# Altium project PCB_60PIN_120PIN.PRJPCB
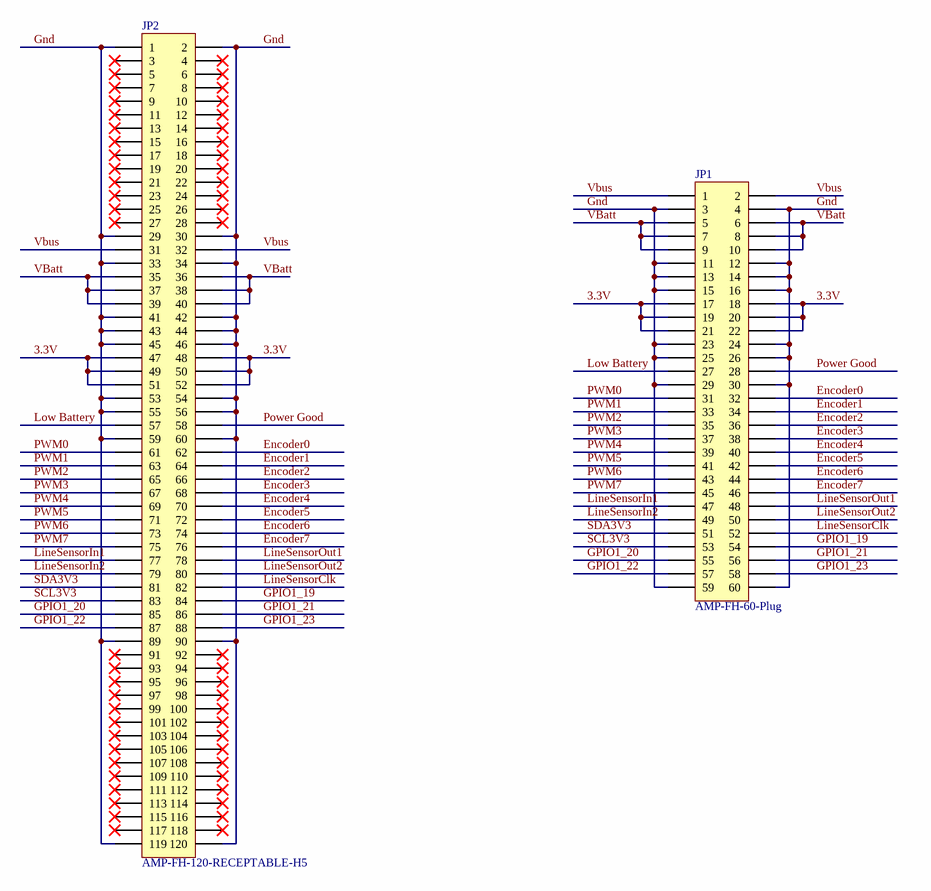
[diagram p0: 60Pin_120Pin.SCHDOC]
1 sheet, 3 parts. Net scope: global (net labels, ports and power ports of the same name join across sheets).
Board file: 60Pin_120Pin.PCBDOC

## Sheet 60Pin_120Pin.SCHDOC: GECKO3power 60-120 Pin Converter
size A4; Organization: Berne University of Applied Science; Address1: Quellgasse 21; Address2: CH-2500 Biel/Bienne; Address3: Switzerland; Revision: 1.0; SheetNumber: 1; SheetTotal: 1; ApprovedBy: zac1; Author: mnb1

### Parts
JP1  AMP-FH-60-Plug  [amp_FH_.8mm_60pin_plug]
JP2  AMP-FH-120-RECEPTABLE-H5  [amp_FH_.8mm_120pin_r_H5]
  CC License  [CC-License]  (value not drawn)

### Nets
3.3V: JP1.17 JP1.18 JP1.19 JP1.20 JP1.21 JP1.22 JP2.47 JP2.48 JP2.49 JP2.50 JP2.51 JP2.52
Encoder0: JP1.32 JP2.62
Encoder1: JP1.34 JP2.64
Encoder2: JP1.36 JP2.66
Encoder3: JP1.38 JP2.68
Encoder4: JP1.40 JP2.70
Encoder5: JP1.42 JP2.72
Encoder6: JP1.44 JP2.74
Encoder7: JP1.46 JP2.76
Gnd: JP1.3 JP1.4 JP1.11 JP1.12 JP1.13 JP1.14 JP1.15 JP1.16 JP1.23 JP1.24 JP1.25 JP1.26 JP1.29 JP1.30 JP1.59 JP1.60 JP2.1 JP2.2 JP2.29 JP2.30 JP2.33 JP2.34 JP2.41 JP2.42 JP2.43 JP2.44 JP2.45 JP2.46 JP2.53 JP2.54 JP2.55 JP2.56 JP2.59 JP2.60 JP2.89 JP2.90 JP2.119 JP2.120
GPIO1_19: JP1.54 JP2.84
GPIO1_20: JP1.55 JP2.85
GPIO1_21: JP1.56 JP2.86
GPIO1_22: JP1.57 JP2.87
GPIO1_23: JP1.58 JP2.88
LineSensorClk: JP1.52 JP2.82
LineSensorIn1: JP1.47 JP2.77
LineSensorIn2: JP1.49 JP2.79
LineSensorOut1: JP1.48 JP2.78
LineSensorOut2: JP1.50 JP2.80
Low Battery: JP1.27 JP2.57
Power Good: JP1.28 JP2.58
PWM0: JP1.31 JP2.61
PWM1: JP1.33 JP2.63
PWM2: JP1.35 JP2.65
PWM3: JP1.37 JP2.67
PWM4: JP1.39 JP2.69
PWM5: JP1.41 JP2.71
PWM6: JP1.43 JP2.73
PWM7: JP1.45 JP2.75
SCL3V3: JP1.53 JP2.83
SDA3V3: JP1.51 JP2.81
VBatt: JP1.5 JP1.6 JP1.7 JP1.8 JP1.9 JP1.10 JP2.35 JP2.36 JP2.37 JP2.38 JP2.39 JP2.40
Vbus: JP1.1 JP1.2 JP2.31 JP2.32

Not connected (* = marked no-connect by the designer): JP2 3* 4* 5* 6* 7* 8* 9* 10* 11* 12* 13* 14* 15* 16* 17* 18* 19* 20* 21* 22* 23* 24* 25* 26* 27* 28* 91* 92* 93* 94* 95* 96* 97* 98* 99* 100* 101* 102* 103* 104* 105* 106* 107* 108* 109* 110* 111* 112* 113* 114* 115* 116* 117* 118*

### Notes on the sheet
- Title:
- Size:
- Date:
- A4_L
- Author:
- Time:
- Revision:
- Sheet
- of
- File:

### Library data of the parts
JP1 = AMP-FH-60-Plug: AMP Free Height System, 0.8mm, 60 Pin, Plug; Part Number: 5177984-2; Value: fh-60p-5mm; Currency: CHF; Packaging unit: 1; Distributor: Farnell; Distributor Number: 1098 336; Manufacturer: AMP; Price: 3.7; RoHS: yes
JP2 = AMP-FH-120-RECEPTABLE-H5: AMP Free Height System, 0.8mm, 120 Pin, 5mm Height, Receptable